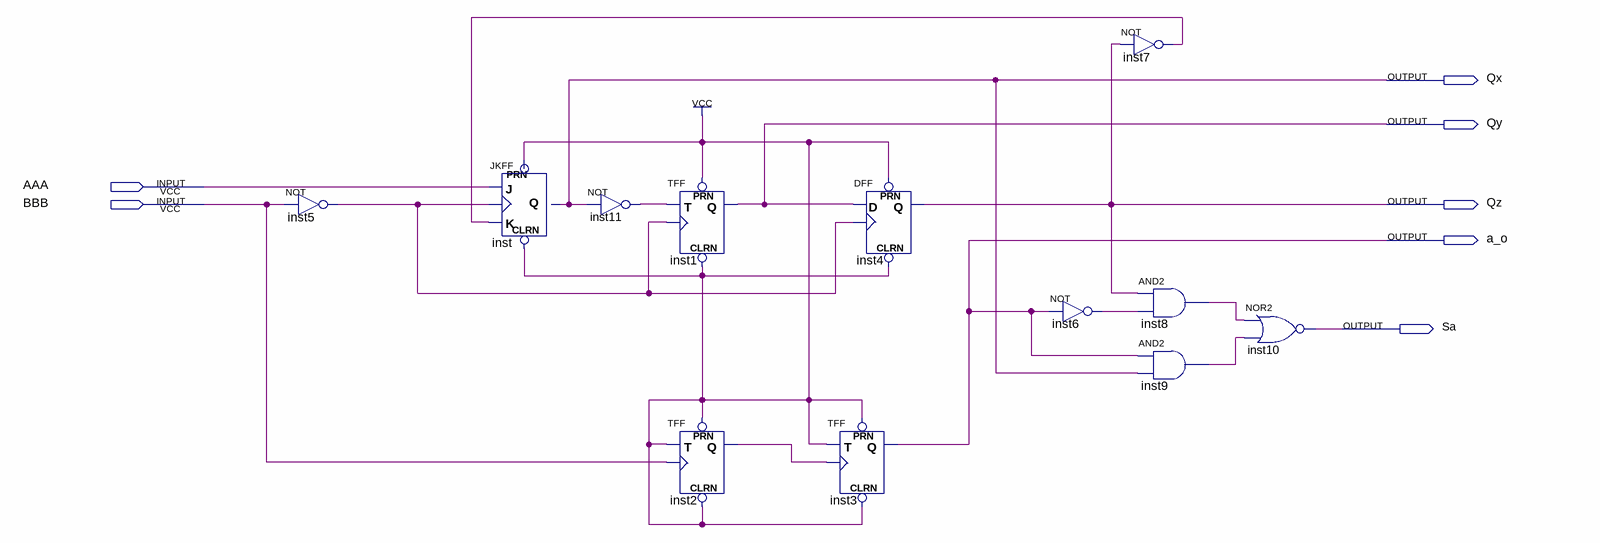
[diagram p0: schematic sheet]
// Quartus schematic main.bdf as structural Verilog: 12 symbols, 7 pins
module main (
  input  AAA,
  input  BBB,
  output Qx,
  output Qy,
  output Qz,
  output a_o,
  output Sa
);

  wire inst2_q, inst5_out, inst6_out, inst7_out, inst8_out, inst9_out, inst11_out;

  not inst5 (inst5_out, BBB);
  JKFF inst (.PRN(1'b1), .CLRN(1'b1), .K(inst7_out), .J(AAA), .CLK(inst5_out), .Q(Qx));
  not inst11 (inst11_out, Qx);
  TFF inst1 (.PRN(1'b1), .CLRN(1'b1), .T(inst11_out), .CLK(inst5_out), .Q(Qy));
  TFF inst2 (.PRN(1'b1), .CLRN(1'b1), .T(1'b1), .CLK(BBB), .Q(inst2_q));
  TFF inst3 (.PRN(1'b1), .CLRN(1'b1), .T(1'b1), .CLK(inst2_q), .Q(a_o));
  DFF inst4 (.CLRN(1'b1), .CLK(inst5_out), .D(Qy), .PRN(1'b1), .Q(Qz));
  not inst6 (inst6_out, a_o);
  not inst7 (inst7_out, Qz);
  and inst8 (inst8_out, Qz, inst6_out);
  and inst9 (inst9_out, a_o, Qx);
  nor inst10 (Sa, inst8_out, inst9_out);
endmodule
